# Altium schematic sheet conn_motor.SchDoc
size A; SheetNumber: 3
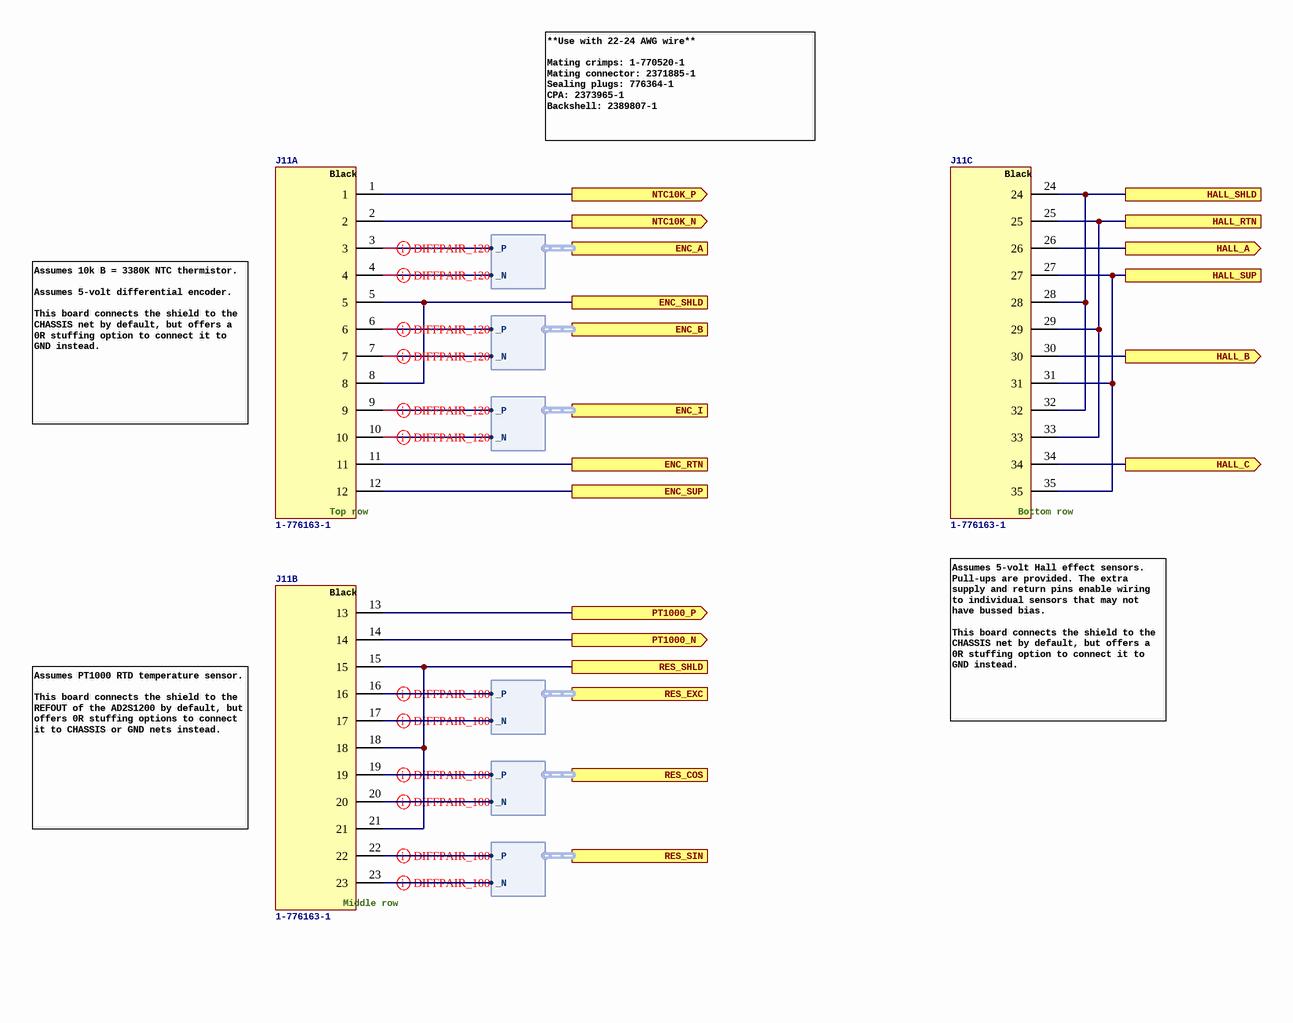
[diagram p0: conn_motor.SchDoc]

## Parts
J11  1-776163-1  [TE_AMPSEAL_1-776163-1]  (parts A,B,C of 3)

## Ports
ENC_A (harness DIFF), ENC_B (harness DIFF), ENC_I (harness DIFF), ENC_RTN, ENC_SHLD, ENC_SUP, HALL_A (out), HALL_B (out), HALL_C (out), HALL_RTN, HALL_SHLD, HALL_SUP, NTC10K_N (out), NTC10K_P (out), PT1000_N (out), PT1000_P (out), RES_COS (harness DIFF), RES_EXC (harness DIFF), RES_SHLD, RES_SIN (harness DIFF)

## Harnesses
DIFF: _P, _N

## Nets
ENC_RTN: J11.11 ; port ENC_RTN
ENC_SHLD: J11.5 J11.8 ; port ENC_SHLD
ENC_SUP: J11.12 ; port ENC_SUP
HALL_A: J11.26 ; port HALL_A
HALL_B: J11.30 ; port HALL_B
HALL_C: J11.34 ; port HALL_C
HALL_RTN: J11.25 J11.29 J11.33 ; port HALL_RTN
HALL_SHLD: J11.24 J11.28 J11.32 ; port HALL_SHLD
HALL_SUP: J11.27 J11.31 J11.35 ; port HALL_SUP
NTC10K_N: J11.2 ; port NTC10K_N
NTC10K_P: J11.1 ; port NTC10K_P
PT1000_N: J11.14 ; port PT1000_N
PT1000_P: J11.13 ; port PT1000_P
RES_SHLD: J11.15 J11.18 J11.21 ; port RES_SHLD
NetJ11_3: J11.3 ; port ENC_A._P
NetJ11_4: J11.4 ; port ENC_A._N
NetJ11_6: J11.6 ; port ENC_B._P
NetJ11_7: J11.7 ; port ENC_B._N
NetJ11_9: J11.9 ; port ENC_I._P
NetJ11_10: J11.10 ; port ENC_I._N
NetJ11_16: J11.16 ; port RES_EXC._P
NetJ11_17: J11.17 ; port RES_EXC._N
NetJ11_19: J11.19 ; port RES_COS._P
NetJ11_20: J11.20 ; port RES_COS._N
NetJ11_22: J11.22 ; port RES_SIN._P
NetJ11_23: J11.23 ; port RES_SIN._N

## Layout directives
differential pair; differential pair class DE_100: NetJ11_3, NetJ11_4, NetJ11_6, NetJ11_7, NetJ11_9, NetJ11_10, NetJ11_16, NetJ11_17, NetJ11_19, NetJ11_20, NetJ11_22, NetJ11_23

## Notes on the sheet
- **Use with 22-24 AWG wire**
  Mating crimps: 1-770520-1
  Mating connector: 2371885-1
  Sealing plugs: 776364-1
  CPA: 2373965-1
  Backshell: 2389807-1
- Assumes 10k B = 3380K NTC thermistor.
  Assumes 5-volt differential encoder.
  This board connects the shield to the CHASSIS net by default, but offers a 0R stuffing option to connect it to GND instead.
- Assumes 5-volt Hall effect sensors. Pull-ups are provided. The extra supply and return pins enable wiring to individual sensors that may not have bussed bias.
  This board connects the shield to the CHASSIS net by default, but offers a 0R stuffing option to connect it to GND instead.
- Assumes PT1000 RTD temperature sensor.
  This board connects the shield to the REFOUT of the AD2S1200 by default, but offers 0R stuffing options to connect it to CHASSIS or GND nets instead.
- (in symbol CONN_AMPSEAL_35POS_RA_1-776163-1, part A) Black; Top row
- (in symbol CONN_AMPSEAL_35POS_RA_1-776163-1, part B) Black; Middle row
- (in symbol CONN_AMPSEAL_35POS_RA_1-776163-1, part C) Black; Bottom row

## Library data of the parts
J11 = CONN_AMPSEAL_35POS_RA_1-776163-1: Conn Power PL 35 POS 4mm Solder RA Thru-Hole 35 Terminal 1 Port, BLACK; Manufacturer: TE Connectivity; Supplier 1: Digikey; Supplier Part Number 1: A106383-ND; Manufacturer Part Number: 1-776163-1; ComponentLink1Description: Product page; ComponentLink1URL: https://www.te.com/en/product-1-776163-1.html; ComponentLink2Description: Drawing; ComponentLink2URL: https://www.te.com/commerce/DocumentDelivery/DDEController?Action=showdoc&DocId=Customer+Drawing%7F776163%7FK%7Fpdf%7FEnglish%7FENG_CD_776163_K.pdf%7F1-776163-1; ComponentLink3Description: Application specification; ComponentLink3URL: https://www.te.com/commerce/DocumentDelivery/DDEController?Action=showdoc&DocId=Specification+Or+Standard%7F114-16016%7FR1%7Fpdf%7FEnglish%7FENG_SS_114-16016_R1.pdf%7F1-776163-1; Supplier 2: LCSC; Supplier Part Number 2: C596198; ComponentLink4Description: Series catalog; ComponentLink4URL: https://www.te.com/commerce/DocumentDelivery/DDEController?Action=showdoc&DocId=Data+Sheet%7F1-1773979-2%7FA%7Fpdf%7FEnglish%7FENG_DS_1-1773979-2_A.pdf%7F1-776280-1; ComponentLink5Description: Product specification; ComponentLink5URL: https://www.te.com/commerce/DocumentDelivery/DDEController?Action=showdoc&DocId=Specification+Or+Standard%7F108-1329%7FE1%7Fpdf%7FEnglish%7FENG_SS_108-1329_E1.pdf%7F1-776163-1